# Altium schematic sheet PowerUnit.SchDoc
size A3
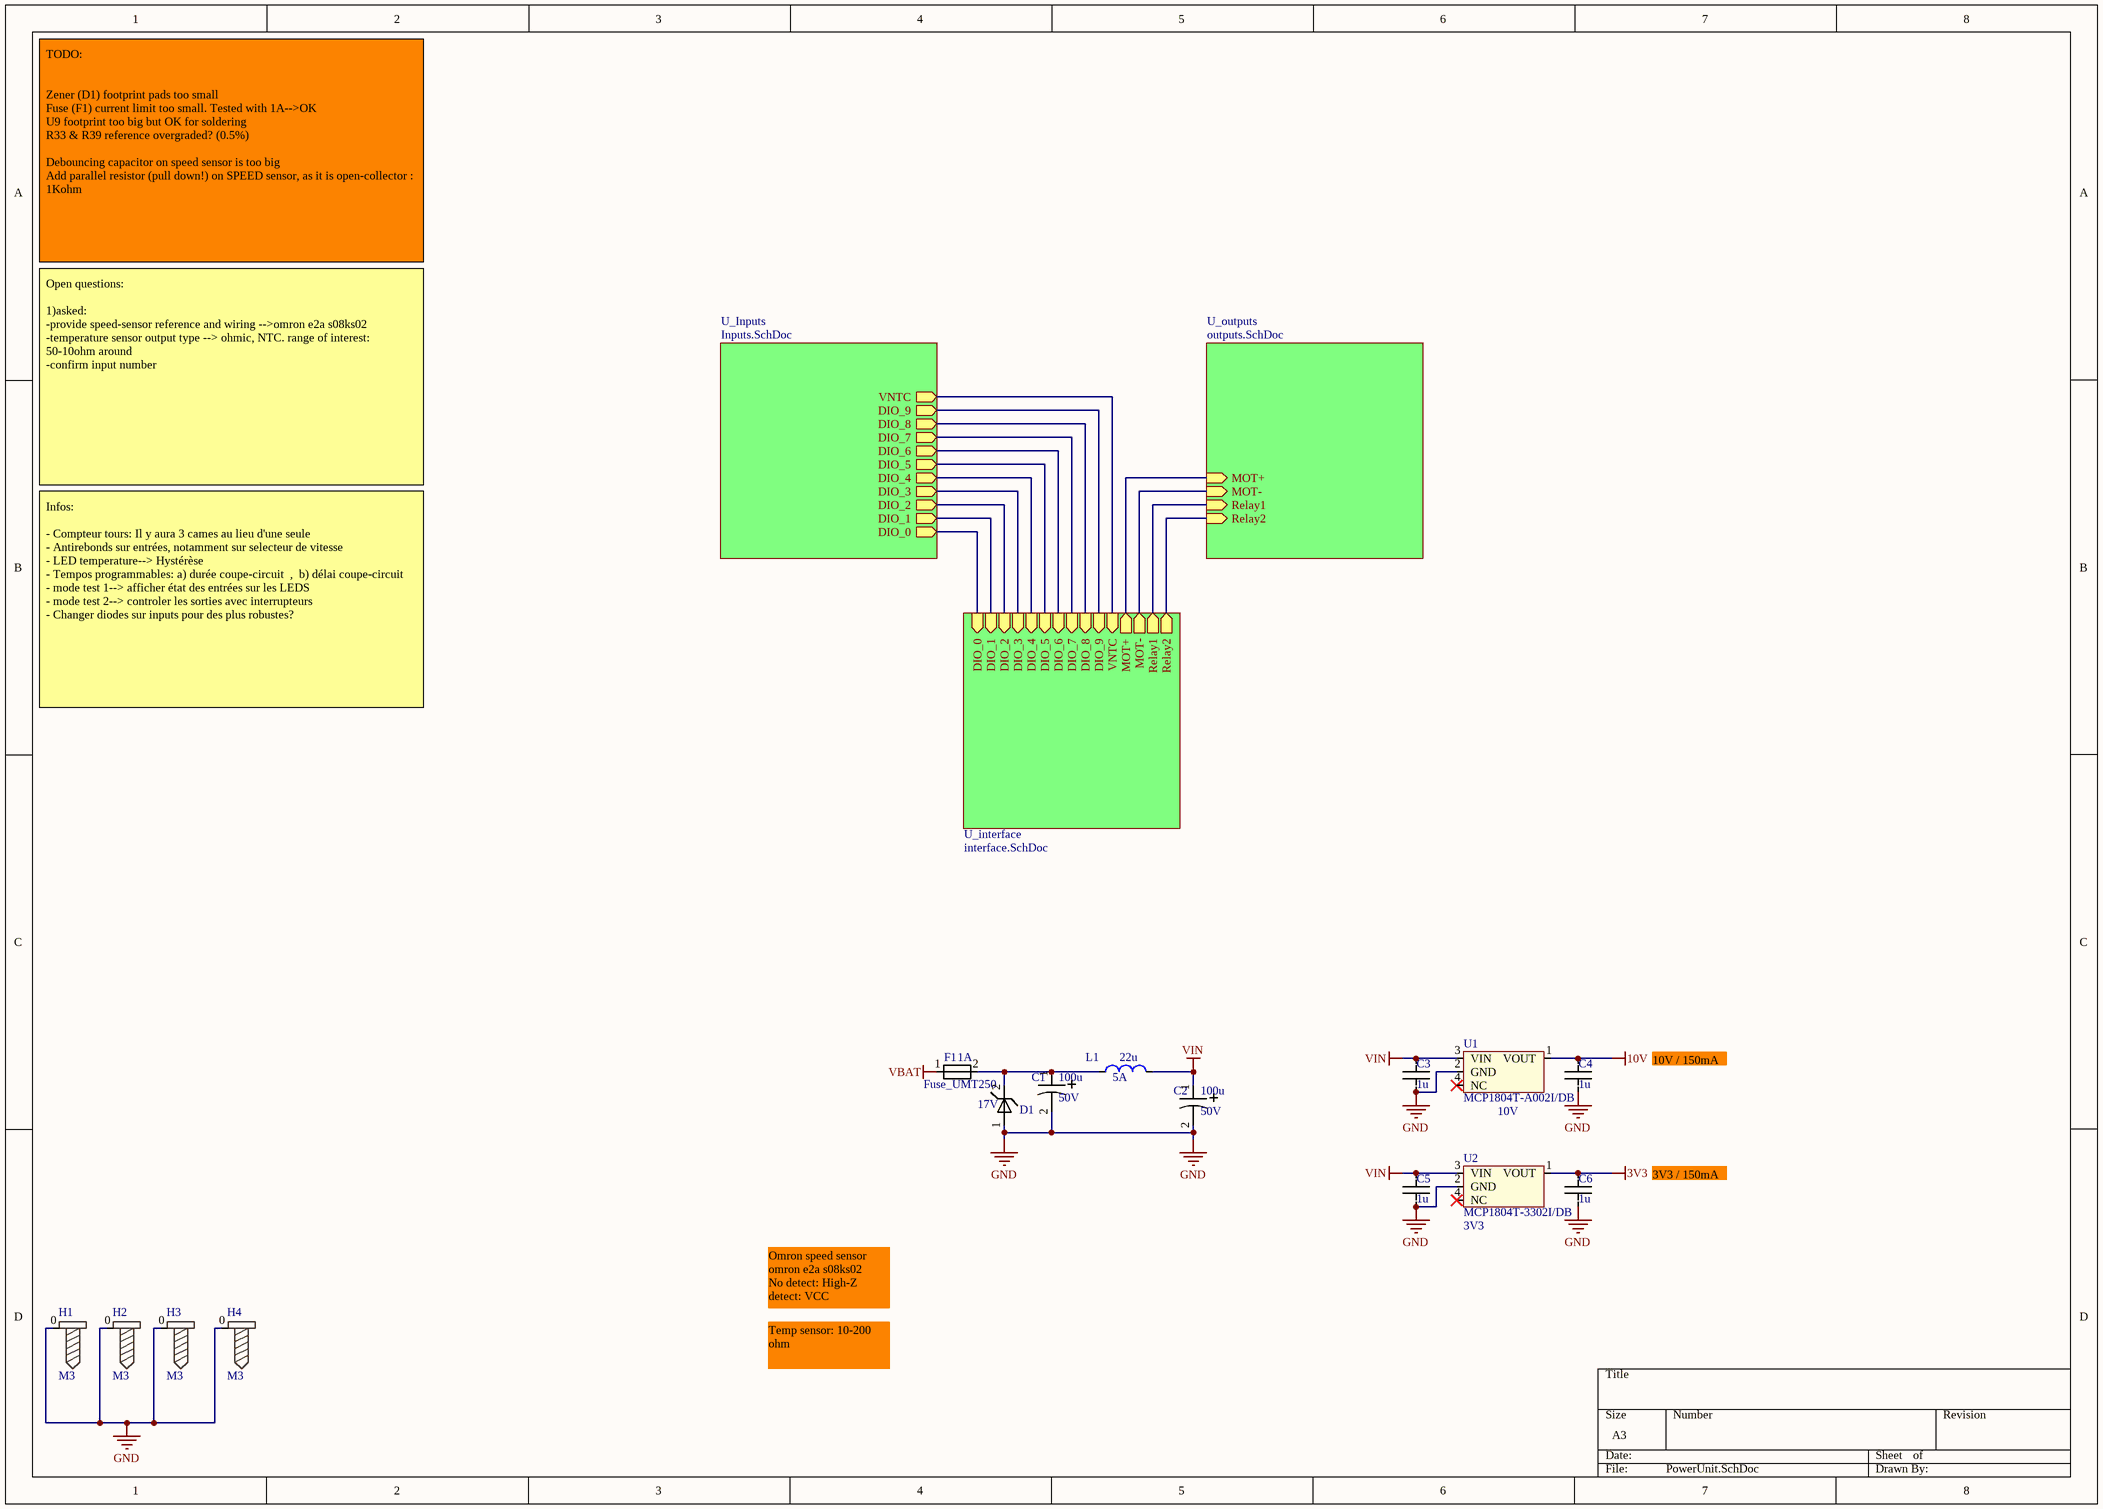
[diagram p0: PowerUnit.SchDoc]

## Parts
C1  value 100u  Rated voltage: 50V  [C_pol8x12mm]  (hidden comment: C_pol)
C2  value 100u  Rated voltage: 50V  [C_pol8x12mm]  (hidden comment: C_pol)
C3  1u  [0402_]
C4  1u  [0402_]
C5  1u  [0402_]
C6  1u  [0402_]
D1  Vz: 17V  [R_DIL_vertical_holes1_2mm]  (hidden comment: Zener)
F1  Fuse_UMT250  Calibre: 1A  [FUSE_UMT250]
H1  M3  [Mechanical_hole]  (no BOM)
H2  M3  [Mechanical_hole]  (no BOM)
H3  M3  [Mechanical_hole]  (no BOM)
H4  M3  [Mechanical_hole]  (no BOM)
L1  value 22u  current: 5A  [WURTH_7447709220]  (hidden comment: Inductor)
U1  MCP1804T-A002I/DB  Output voltage: 10V  [SOT223-4M]
U2  MCP1804T-3302I/DB  Output voltage: 3V3  [SOT223-4M]

## Sub-sheets
U_Inputs = Inputs.SchDoc: DIO_0 (out), DIO_1 (out), DIO_2 (out), DIO_3 (out), DIO_4 (out), DIO_5 (out), DIO_6 (out), DIO_7 (out), VNTC (out), DIO_8 (out), DIO_9 (out)
U_interface = interface.SchDoc: DIO_0 (in), DIO_1 (in), DIO_2 (in), DIO_3 (in), DIO_4 (in), DIO_5 (in), DIO_6 (in), DIO_7 (in), VNTC (in), MOT+ (out), MOT- (out), DIO_8 (in), DIO_9 (in), Relay2 (out), Relay1 (out)
U_outputs = outputs.SchDoc: MOT+ (in), MOT- (in), Relay2 (in), Relay1 (in)

## Nets
3V3: C6.1 U2.1(VOUT)
10V: C4.1 U1.1(VOUT)
GND: C1.2 C2.2 C3.2 C4.2 C5.2 C6.2 D1.1 H1.0 H2.0 H3.0 H4.0 U1.2(GND) U2.2(GND)
VBAT: F1.1
VIN: C2.1 C3.1 C5.1 L1.2 U1.3(VIN) U2.3(VIN)
NetC1_1: C1.1 D1.2 F1.2 L1.1
(unnamed): sheet U_Inputs/DIO_0, sheet U_interface/DIO_0
(unnamed): sheet U_Inputs/DIO_1, sheet U_interface/DIO_1
(unnamed): sheet U_Inputs/DIO_2, sheet U_interface/DIO_2
(unnamed): sheet U_Inputs/DIO_3, sheet U_interface/DIO_3
(unnamed): sheet U_Inputs/DIO_4, sheet U_interface/DIO_4
(unnamed): sheet U_Inputs/DIO_5, sheet U_interface/DIO_5
(unnamed): sheet U_Inputs/DIO_6, sheet U_interface/DIO_6
(unnamed): sheet U_Inputs/DIO_7, sheet U_interface/DIO_7
(unnamed): sheet U_Inputs/VNTC, sheet U_interface/VNTC
(unnamed): sheet U_Inputs/DIO_8, sheet U_interface/DIO_8
(unnamed): sheet U_Inputs/DIO_9, sheet U_interface/DIO_9
(unnamed): sheet U_outputs/MOT+, sheet U_interface/MOT+
(unnamed): sheet U_outputs/MOT-, sheet U_interface/MOT-
(unnamed): sheet U_outputs/Relay2, sheet U_interface/Relay2
(unnamed): sheet U_outputs/Relay1, sheet U_interface/Relay1

Not connected (* = marked no-connect by the designer): U1 4(NC)*; U2 4(NC)*

## Notes on the sheet
- TODO:
  Zener (D1) footprint pads too small
  Fuse (F1) current limit too small. Tested with 1A-->OK
  U9 footprint too big but OK for soldering
  R33 & R39 reference overgraded? (0.5%)
  Debouncing capacitor on speed sensor is too big
  Add parallel resistor (pull down!) on SPEED sensor, as it is open-collector : 1Kohm
- Open questions:
  1)asked:
  -provide speed-sensor reference and wiring -->omron e2a s08ks02
  -temperature sensor output type --> ohmic, NTC. range of interest: 50-10ohm around
  -confirm input number
- Infos:
  - Compteur tours: Il y aura 3 cames au lieu d'une seule
  - Antirebonds sur entrées, notamment sur selecteur de vitesse
  - LED temperature--> Hystérèse
  - Tempos programmables: a) durée coupe-circuit  ,  b) délai coupe-circuit
  - mode test 1--> afficher état des entrées sur les LEDS
  - mode test 2--> controler les sorties avec interrupteurs
  - Changer diodes sur inputs pour des plus robustes?
- 10V / 150mA
- 3V3 / 150mA
- Omron speed sensor
  omron e2a s08ks02
  No detect: High-Z
  detect: VCC
- Temp sensor: 10-200 ohm

## Library data of the parts
C1 C2 = C_pol: Manufacturer: Nichicon; Manufacturer PartNum: UVR1H101MPD1TD; Digikey ref: 493-5916-1-ND
C3-C6 = C: Manufacturer PartNum: GRM155R61E105MA12D; Manufacturer: Murata; Nominal voltage: 25V; value: 1u; Digikey ref: 490-10018-1-ND
D1 = Zener: Manufacturer: ON Semi; Manufacturer PartNum: 1N5354BG; Digikey ref: 1N5354BGOS-ND
F1 = Fuse_UMT250: Manufacturer PartNum: 3403.0166.11; Manufacturer: Schurter Inc; Unominal: 250V; Type: Temporisé; Digikey ref: 486-1247-ND; Farnell ref: 1221090; Mouser ref: 693-3403.0166.11
H1-H4 = trous_de_fixation: value: M3
L1 = Inductor: Manufacturer PartNum: 7447709220; Manufacturer: Wurth Electronics Inc; Digikey ref: 732-1243-1-ND; Digikey ref 2 (was unavailable): SRP1038A-220MCT-ND
U1 = MCP1804T-A002I/DB: IC REG LDO 10V 0.15A SOT223-3; Manufacturer: Microchip; Digikey ref: MCP1804T-A002I/DBCT-ND; Manufacturer PartNum: MCP1804T-A002I/DB
U2 = MCP1804T-3302I/DB: IC REG LDO 3.3V 0.15A SOT223-3; Manufacturer: Microchip; Digikey ref: MCP1804T-3302I/DBCT-ND; Manufacturer PartNum: MCP1804T-3302I/DB